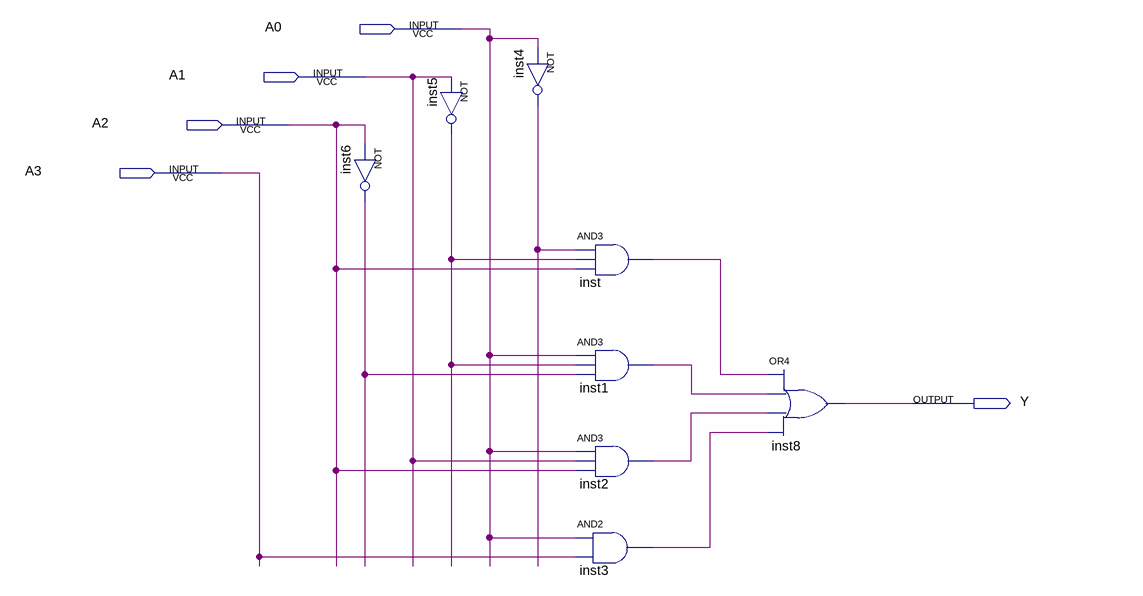
[diagram p0: schematic sheet]
// Quartus schematic Segment3.bdf as structural Verilog: 8 symbols, 5 pins
module Segment3 (
  input  A0,
  input  A1,
  input  A2,
  input  A3,
  output Y
);

  wire inst1_out, inst2_out, inst3_out, inst4_out, inst5_out, inst6_out, inst_out;

  not inst6 (inst6_out, A2);
  not inst5 (inst5_out, A1);
  not inst4 (inst4_out, A0);
  and inst (inst_out, inst4_out, inst5_out, A2);
  and inst1 (inst1_out, A0, inst5_out, inst6_out);
  and inst2 (inst2_out, A0, A1, A2);
  and inst3 (inst3_out, A0, A3);
  or inst8 (Y, inst_out, inst1_out, inst2_out, inst3_out);
endmodule
